# EasyEDA schematic Power Supply Adapter Schematic.json
TITLE: Power Supply Adapter; REV: 1.0; Date: 2019-10-09; Sheet: 1/1; Drawn By: Noothless
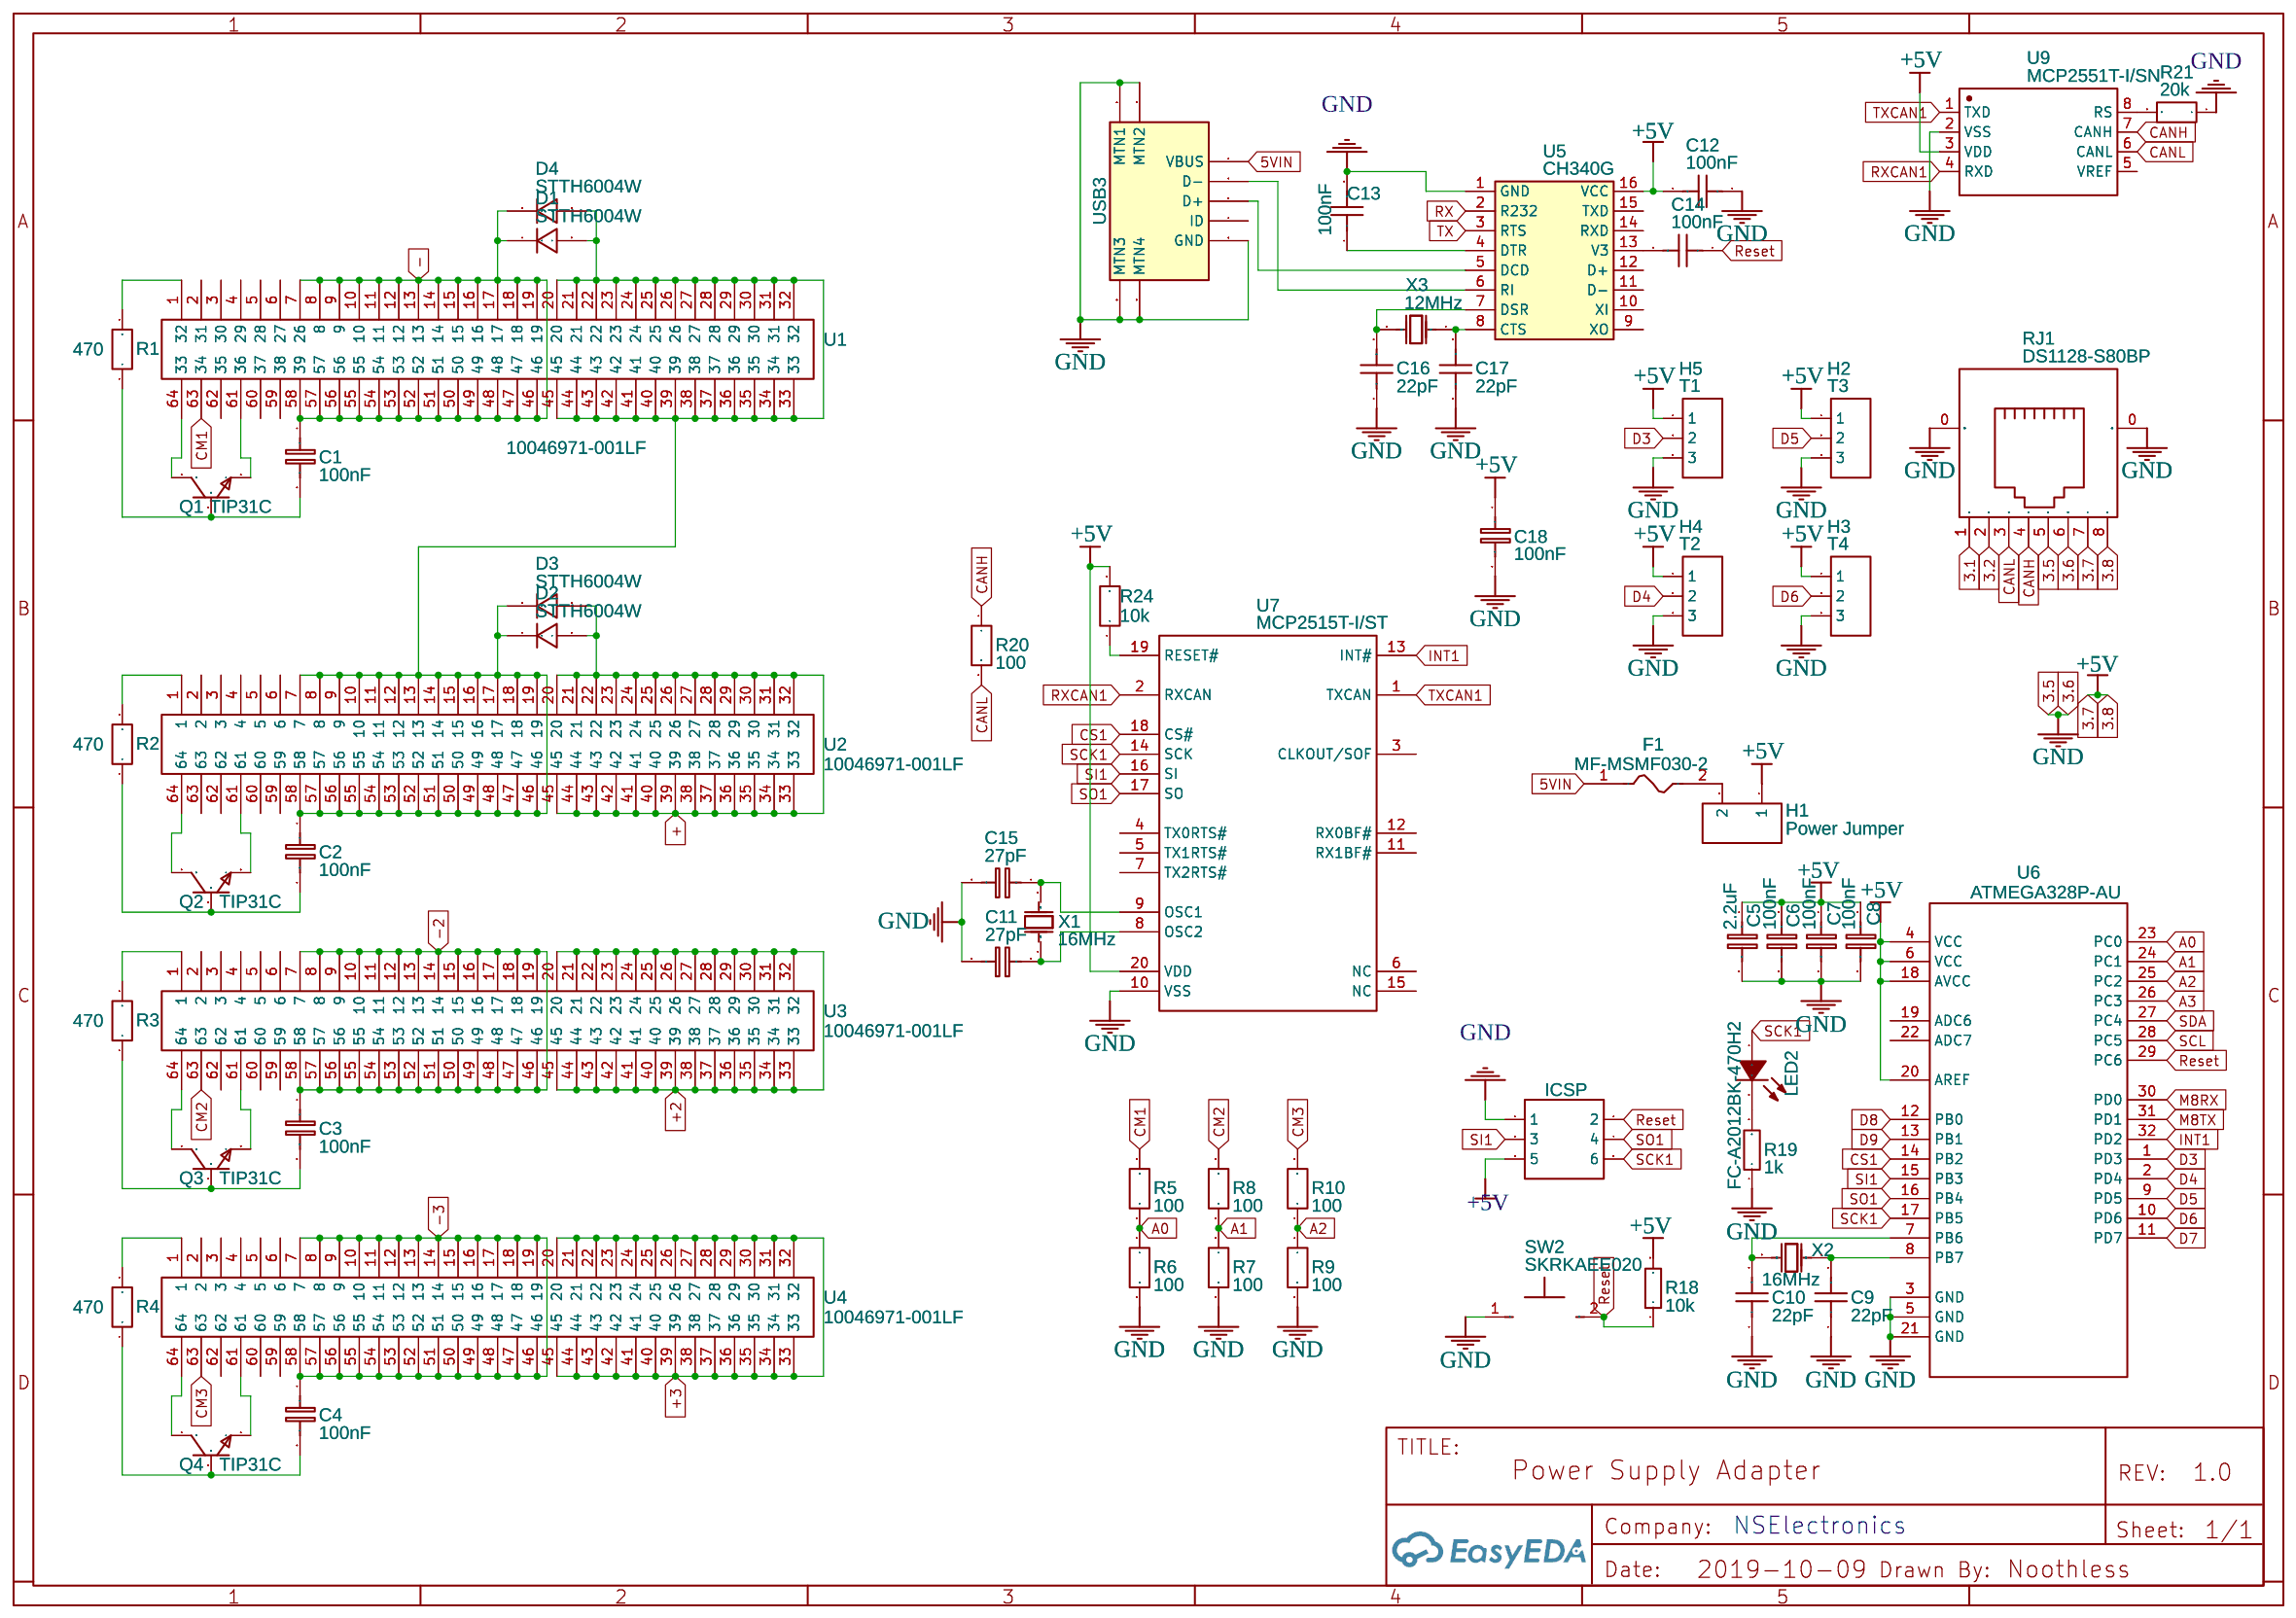
[diagram p0: schematic sheet]

## Parts
C1  100nF  [0805]
C2  100nF  [0805]
C3  100nF  [0805]
C4  100nF  [0805]
C5  2.2uF  [0805]
C6  100nF  [0805]
C7  100nF  [0805]
C8  100nF  [0805]
C9  22pF  [0805]
C10  22pF  [0805]
C11  27pF  [0805]
C12  100nF  [0805]
C13  100nF  [0805]
C14  100nF  [0805]
C15  27pF  [0805]
C16  22pF  [0805]
C17  22pF  [0805]
C18  100nF  [0805]
D1  STTH6004W  [DO-247_L15.6-W5.0-P10.90]
D2  STTH6004W  [DO-247_L15.6-W5.0-P10.90]
D3  STTH6004W  [DO-247_L15.6-W5.0-P10.90]
D4  STTH6004W  [DO-247_L15.6-W5.0-P10.90]
F1  MF-MSMF030-2  [1812]
H1  Power Jumper  [HDR-2X1/2.54]
H2  T3  [HDR-TH_3P-P2.54-V]
H3  T4  [HDR-TH_3P-P2.54-V]
H4  T2  [HDR-TH_3P-P2.54-V]
H5  T1  [HDR-TH_3P-P2.54-V]
ICSP2  ICSP  [HDR-3X2/2.54]
LED2  FC-A2012BK-470H2  [LED-0805]
Q1  TIP31C  [TO-220(TO-220-3)]
Q2  TIP31C  [TO-220(TO-220-3)]
Q3  TIP31C  [TO-220(TO-220-3)]
Q4  TIP31C  [TO-220(TO-220-3)]
R1  470  [0805]
R2  470  [0805]
R3  470  [0805]
R4  470  [0805]
R5  100  [0805]
R6  100  [0805]
R7  100  [0805]
R8  100  [0805]
R9  100  [0805]
R10  100  [0805]
R18  10k  [0805]
R19  1k  [0805]
R20  100  [0805]
R21  20k  [0805]
R24  10k  [0805]
RJ1  DS1128-S80BP  [RJ45-CONNFLY-DS1128-3.68MM]
SW2  SKRKAEE020  [SKRKAEE020]
U1  10046971-001LF  [10046971-001LF PCBLIB]
U2  10046971-001LF  [10046971-001LF PCBLIB]
U3  10046971-001LF  [10046971-001LF PCBLIB]
U4  10046971-001LF  [10046971-001LF PCBLIB]
U5  CH340G  [SOIC-16_150MIL]
U6  ATMEGA328P-AU  [TQFP-32_7X7X08P]
U7  MCP2515T-I/ST  [TSSOP-20_L6.5-W4.4-P0.65-LS6.4-BL]
U9  MCP2551T-I/SN  [SOIC-8_L5.0-W4.0-P1.27-LS6.0-BL]
USB3  MINI 5PMotherboard Copper shell with column LCPVinyl  [USB-MINI-3]
X1  16MHz  [OSC-49S-1]
X2  16MHz  [OSC-49S-1]
X3  12MHz  [OSC-49S-1]

## Library data of the parts
C1-C4 = Cap_0805_EU: Manufacturer Part: CL21B104KBCNNNC; Supplier: LCSC; Manufacturer: SAMSUNG; Supplier Part: C1711
C5-C8 = Cap_1206_EU: Manufacturer Part: CL21B104KBCNNNC; Supplier: LCSC; Manufacturer: SAMSUNG; Supplier Part: C1711
C9 C10 C16 C17 = Cap_0805_US: Manufacturer Part: 0805CG220J500NT; Supplier: LCSC; Manufacturer: FH; Supplier Part: C38143
C11 C15 C18 = Cap_0805_EU
C12 C13 = Cap_0805_US: Manufacturer Part: CL21B104KBCNNNC; Supplier: LCSC; Manufacturer: SAMSUNG; Supplier Part: C1711
C14 = Cap_0805_US: Manufacturer Part: ?
D1-D4 = -: Supplier Part: C169788; Supplier: LCSC; Manufacturer: STMicroelectronics; Contributor: LCSC
F1 = -: Supplier: LCSC; Manufacturer: BOURNS; image: //image.lceda.cn/szlcsc/C12604.jpg; Contributor: LCSC; Supplier Part: C12604
H1 = Header-Male-2.54_1x2: Supplier: LCSC; Manufacturer: TE Connectivity; Manufacturer Part: 826629-2; image: //image.lceda.cn/szlcsc/C86471.jpg; Supplier Part: C86471
H2-H5 = Header-Male-2.54_1x3: Supplier: LCSC; Manufacturer: BOOMELE; Manufacturer Part: Header2.54mm 1*3P; image: //image.lceda.cn/szlcsc/C49257.jpg; Supplier Part: C49257
ICSP2 = -: Supplier Part: C65114; Supplier: LCSC; Manufacturer: BOOMELE; Manufacturer Part: Header-Male-2.54_2x3
LED2 = -: Supplier: LCSC; Manufacturer: NATIONSTAR; Contributor: LCSC; Supplier Part: C84259
Q1-Q4 = -: Supplier: LCSC; Manufacturer: STMicroelectronics; image: //image.lceda.cn/szlcsc/C13506.jpg; Supplier Part: C13506
R1-R4 = Res_0805(1/8W)_EU: Manufacturer Part: 0805W8J0471T5E; Supplier: LCSC; Manufacturer: UniOhm; Supplier Part: C21266
R5-R10 R20 R21 R24 = Res_0805(1/8W)_EU
R18 = Res_0805(1/8W)_EU: Manufacturer Part: 0805W8F1002T5E; Supplier: LCSC; Manufacturer: UniOhm; Supplier Part: C17414
R19 = Res_0805(1/8W)_EU: Manufacturer Part: 0805W8F1001T5E; Supplier: LCSC; Manufacturer: UniOhm; Supplier Part: C17513
RJ1 = -: Supplier: LCSC; Manufacturer: CONNFLY; Contributor: LCSC; Supplier Part: C86586
SW2 = -: Supplier: LCSC; Manufacturer: ALPS; Supplier Part: C115357
U1-U4 = -: Manufacturer: Amphenol ICC; Supplier: Digi-Key; Supplier Part: 609-2863-ND; link: https://www.digikey.ch/product-detail/en/amphenol-icc-fci/10046971-001LF/609-2863-ND/1493072; Contributor: Noothless2
U5 = -: Supplier: LCSC; Manufacturer: WCH; LCSC Assembly: Yes; image: //image.lceda.cn/szlcsc/C14267.jpg; Contributor: LCSC; Supplier Part: C14267
U6 = -: Supplier: LCSC; Manufacturer: MICROCHIP; image: //image.lceda.cn/szlcsc/C14877.jpg; Supplier Part: C14877
U7 = MCP2515T-I/ST: Supplier: LCSC; Supplier Part: C185941; Manufacturer: Microchip Tech; Contributor: LCSC; LCSC Assembly: Yes; SMT Type: Extend
U9 = -: Supplier: LCSC; Manufacturer: MICROCHIP; image: //image.lceda.cn/szlcsc/C49558.jpg; Supplier Part: C49558; LCSC Assembly: Yes; SMT Type: Extend
USB3 = -: Supplier: LCSC; Manufacturer: ValuePro; image: //image.lceda.cn/szlcsc/C46391.jpg; Contributor: LCSC; Supplier Part: C46391
X1 X2 = X49SD16MSD2SC: Supplier: LCSC; Manufacturer: YXC; Supplier Part: C16212
X3 = X49SD12MSD2SC: Supplier: LCSC; Manufacturer: YXC; Supplier Part: C16369

## Nets
5VIN: F1.1 USB3.1(VBUS)
+5V: C5.1 C6.1 C7.1 C8.1 C12.2 C18.1 H1.1 H2.1 H3.1 H4.1 H5.1 ICSP2.5 R18.2 R24.2 RJ1.7 RJ1.8 U5.16(VCC) U6.4(VCC) U6.6(VCC) U6.18(AVCC) U6.20(AREF) U7.20(VDD) U9.3(VDD)
3.1: RJ1.1
3.2: RJ1.2
3.5: C5.2 C6.2 C7.2 C8.2 C9.1 C10.1 C11.2 C12.1 C13.2 C15.2 C16.1 C17.1 C18.2 H2.3 H3.3 H4.3 H5.3 ICSP2.1 R6.2 R7.2 R9.2 R19.1 R21.1 RJ1.0(SHIELD) RJ1.5 RJ1.6 SW2.1 U5.1(GND) U6.3(GND) U6.5(GND) U6.21(GND) U7.10(VSS) U9.2(VSS) USB3.0(MTN1) USB3.5(GND)
+: D2.2(A) D3.2(A) U2.20 U2.21 U2.22 U2.23 U2.24 U2.25 U2.26 U2.27 U2.28 U2.29 U2.30 U2.31 U2.32 U2.33 U2.34 U2.35 U2.36 U2.37 U2.38 U2.39 U2.40 U2.41 U2.42 U2.43 U2.44 U2.45
+2: U3.20 U3.21 U3.22 U3.23 U3.24 U3.25 U3.26 U3.27 U3.28 U3.29 U3.30 U3.31 U3.32 U3.33 U3.34 U3.35 U3.36 U3.37 U3.38 U3.39 U3.40 U3.41 U3.42 U3.43 U3.44 U3.45
+3: U4.20 U4.21 U4.22 U4.23 U4.24 U4.25 U4.26 U4.27 U4.28 U4.29 U4.30 U4.31 U4.32 U4.33 U4.34 U4.35 U4.36 U4.37 U4.38 U4.39 U4.40 U4.41 U4.42 U4.43 U4.44 U4.45
-: C1.1 D1.1(K) D4.1(K) U1.7(26) U1.8 U1.9 U1.10 U1.11 U1.12 U1.13 U1.14 U1.15 U1.16 U1.17 U1.18 U1.19 U1.46 U1.47 U1.48 U1.49 U1.50 U1.51 U1.52 U1.53 U1.54 U1.55 U1.56 U1.57 U1.58(39)
-2: C3.1 U3.7 U3.8 U3.9 U3.10 U3.11 U3.12 U3.13 U3.14 U3.15 U3.16 U3.17 U3.18 U3.19 U3.46 U3.47 U3.48 U3.49 U3.50 U3.51 U3.52 U3.53 U3.54 U3.55 U3.56 U3.57 U3.58
-3: C4.1 U4.7 U4.8 U4.9 U4.10 U4.11 U4.12 U4.13 U4.14 U4.15 U4.16 U4.17 U4.18 U4.19 U4.46 U4.47 U4.48 U4.49 U4.50 U4.51 U4.52 U4.53 U4.54 U4.55 U4.56 U4.57 U4.58
A0: R5.1 R6.1 U6.23(PC0)
A1: R7.1 R8.1 U6.24(PC1)
A2: R9.1 R10.1 U6.25(PC2)
A3: U6.26(PC3)
CANH: R20.1 RJ1.4 U9.7(CANH)
CANL: R20.2 RJ1.3 U9.6(CANL)
CM1: R5.2 U1.63(34)
CM2: R8.2 U3.63
CM3: R10.2 U4.63
CS1: U6.14(PB2) U7.18(CS#)
D3: H5.2 U6.1(PD3)
D4: H4.2 U6.2(PD4)
D5: H2.2 U6.9(PD5)
D6: H3.2 U6.10(PD6)
D7: U6.11(PD7)
D8: U6.12(PB0)
D9: U6.13(PB1)
INT1: U6.32(PD2) U7.13(INT#)
M8RX: U6.30(PD0)
M8TX: U6.31(PD1)
Reset: C14.1 ICSP2.2 R18.1 SW2.2 U6.29(PC6)
RX: U5.2(R232)
RXCAN1: U7.2(RXCAN) U9.4(RXD)
SCK1: ICSP2.6 LED2.1(A) U6.17(PB5) U7.14(SCK)
SCL: U6.28(PC5)
SDA: U6.27(PC4)
SI1: ICSP2.3 U6.15(PB3) U7.16(SI)
SO1: ICSP2.4 U6.16(PB4) U7.17(SO)
TX: U5.3(RTS)
TXCAN1: U7.1(TXCAN) U9.1(TXD)
Net-(C1-2): C1.2 Q1.1(B) R1.1
Net-(C2-1): C2.1 D1.2(A) D2.1(K) D3.1(K) D4.2(A) U1.20 U1.21 U1.22 U1.23 U1.24 U1.25 U1.26 U1.27 U1.28 U1.29 U1.30 U1.31 U1.32 U1.33 U1.34 U1.35 U1.36 U1.37 U1.38 U1.39 U1.40 U1.41 U1.42 U1.43 U1.44 U1.45 U2.7 U2.8 U2.9 U2.10 U2.11 U2.12 U2.13 U2.14 U2.15 U2.16 U2.17 U2.18 U2.19 U2.46 U2.47 U2.48 U2.49 U2.50 U2.51 U2.52 U2.53 U2.54 U2.55 U2.56 U2.57 U2.58
Net-(C2-2): C2.2 Q2.1(B) R2.1
Net-(C3-2): C3.2 Q3.1(B) R3.1
Net-(C4-2): C4.2 Q4.1(B) R4.1
Net-(C9-2): C9.2 U6.8(PB7) X2.1(OSC1)
Net-(C10-2): C10.2 U6.7(PB6) X2.2(OSC2)
Net-(C11-1): C11.1 U7.8(OSC2) X1.1(OSC1)
Net-(C13-1): C13.1 U5.4(DTR)
Net-(C14-2): C14.2 U5.13(V3)
Net-(C15-1): C15.1 U7.9(OSC1) X1.2(OSC2)
Net-(C16-2): C16.2 U5.7(DSR) X3.2(OSC2)
Net-(C17-2): C17.2 U5.8(CTS) X3.1(OSC1)
Net-(F1-2): F1.2 H1.2
Net-(LED2-2): LED2.2(K) R19.2
Net-(Q1-2): Q1.2(C) U1.64(33)
Net-(Q1-3): Q1.3(E) U1.61(36)
Net-(Q2-2): Q2.2(C) U2.64
Net-(Q2-3): Q2.3(E) U2.61
Net-(Q3-2): Q3.2(C) U3.64
Net-(Q3-3): Q3.3(E) U3.61
Net-(Q4-2): Q4.2(C) U4.64
Net-(Q4-3): Q4.3(E) U4.61
Net-(R1-2): R1.2 U1.1(32)
Net-(R2-2): R2.2 U2.1
Net-(R3-2): R3.2 U3.1
Net-(R4-2): R4.2 U4.1
Net-(R21-2): R21.2 U9.8(RS)
Net-(R24-1): R24.1 U7.19(RESET#)
Net-(U5-5): U5.5(DCD) USB3.3(D+)
Net-(U5-6): U5.6(RI) USB3.2(D-)

Not connected (* = marked no-connect by the designer): U1 2(31) 3(30) 4(29) 5(28) 6(27) 59(38) 60(37) 62(35); U2 2 3 4 5 6 59 60 62 63; U3 2 3 4 5 6 59 60 62; U4 2 3 4 5 6 59 60 62; U5 9(XO) 10(XI) 11(D-) 12(D+) 14(RXD) 15(TXD); U6 19(ADC6) 22(ADC7); U7 3(CLKOUT/SOF) 4(TX0RTS#) 5(TX1RTS#) 6(NC) 7(TX2RTS#) 11(RX1BF#) 12(RX0BF#) 15(NC); U9 5(VREF); USB3 4(ID)

## Notes on the sheet
- NSElectronics
